# EAGLE design Braille_Cell (EAGLE 7.2.0)
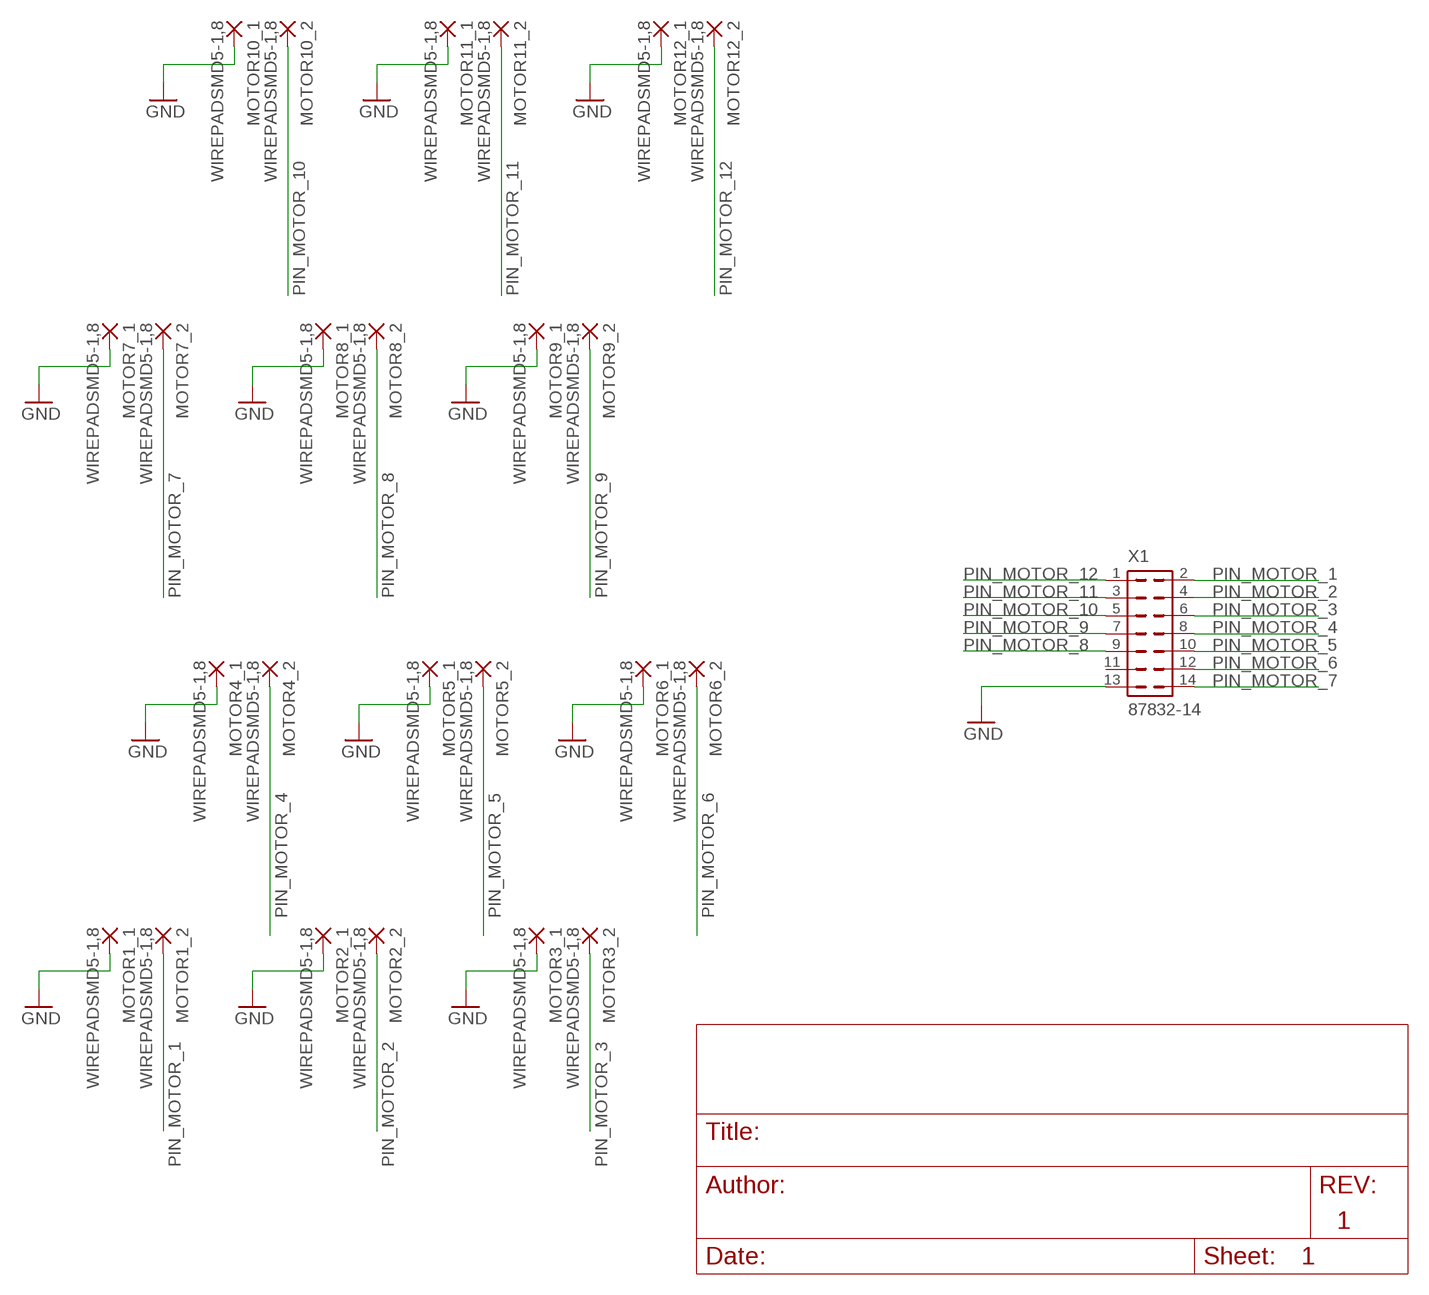
[diagram p0: schematic, sheet 1]
FRAME1 (DINA4_P): AUTHOR: Christoph Ulbinger, BSc; TITLE: Braille Cell

## Parts
MOTOR1_1  WIREPADSMD5-1,8  [5-1,8]
MOTOR1_2  WIREPADSMD5-1,8  [5-1,8]
MOTOR2_1  WIREPADSMD5-1,8  [5-1,8]
MOTOR2_2  WIREPADSMD5-1,8  [5-1,8]
MOTOR3_1  WIREPADSMD5-1,8  [5-1,8]
MOTOR3_2  WIREPADSMD5-1,8  [5-1,8]
MOTOR4_1  WIREPADSMD5-1,8  [5-1,8]
MOTOR4_2  WIREPADSMD5-1,8  [5-1,8]
MOTOR5_1  WIREPADSMD5-1,8  [5-1,8]
MOTOR5_2  WIREPADSMD5-1,8  [5-1,8]
MOTOR6_1  WIREPADSMD5-1,8  [5-1,8]
MOTOR6_2  WIREPADSMD5-1,8  [5-1,8]
MOTOR7_1  WIREPADSMD5-1,8  [5-1,8]
MOTOR7_2  WIREPADSMD5-1,8  [5-1,8]
MOTOR8_1  WIREPADSMD5-1,8  [5-1,8]
MOTOR8_2  WIREPADSMD5-1,8  [5-1,8]
MOTOR9_1  WIREPADSMD5-1,8  [5-1,8]
MOTOR9_2  WIREPADSMD5-1,8  [5-1,8]
MOTOR10_1  WIREPADSMD5-1,8  [5-1,8]
MOTOR10_2  WIREPADSMD5-1,8  [5-1,8]
MOTOR11_1  WIREPADSMD5-1,8  [5-1,8]
MOTOR11_2  WIREPADSMD5-1,8  [5-1,8]
MOTOR12_1  WIREPADSMD5-1,8  [5-1,8]
MOTOR12_2  WIREPADSMD5-1,8  [5-1,8]
X1  87832-14  [87832-14]

## Nets
GND: MOTOR1_1.1(P) MOTOR2_1.1(P) MOTOR3_1.1(P) MOTOR4_1.1(P) MOTOR5_1.1(P) MOTOR6_1.1(P) MOTOR7_1.1(P) MOTOR8_1.1(P) MOTOR9_1.1(P) MOTOR10_1.1(P) MOTOR11_1.1(P) MOTOR12_1.1(P) X1.13
PIN_MOTOR_1: MOTOR1_2.1(P) X1.2
PIN_MOTOR_2: MOTOR2_2.1(P) X1.4
PIN_MOTOR_3: MOTOR3_2.1(P) X1.6
PIN_MOTOR_4: MOTOR4_2.1(P) X1.8
PIN_MOTOR_5: MOTOR5_2.1(P) X1.10
PIN_MOTOR_6: MOTOR6_2.1(P) X1.12
PIN_MOTOR_7: MOTOR7_2.1(P) X1.14
PIN_MOTOR_8: MOTOR8_2.1(P) X1.9
PIN_MOTOR_9: MOTOR9_2.1(P) X1.7
PIN_MOTOR_10: MOTOR10_2.1(P) X1.5
PIN_MOTOR_11: MOTOR11_2.1(P) X1.3
PIN_MOTOR_12: MOTOR12_2.1(P) X1.1
Unconnected: X1.11

## Library data of the parts
MOTOR1_1 MOTOR1_2 MOTOR2_1 MOTOR2_2 MOTOR3_1 MOTOR3_2 MOTOR4_1 MOTOR4_2 MOTOR5_1 MOTOR5_2 MOTOR6_1 MOTOR6_2 MOTOR7_1 MOTOR7_2 MOTOR8_1 MOTOR8_2 MOTOR9_1 MOTOR9_2 MOTOR10_1 MOTOR10_2 MOTOR11_1 MOTOR11_2 MOTOR12_1 MOTOR12_2 = wirepad:WIREPAD: Wire PAD connect wire on PCB
X1 = con-molex:87832-14: Milli-Grid Header 2.00mm (.079") Pitch; OC_FARNELL: 7434698; OC_NEWARK: unknown

## Board
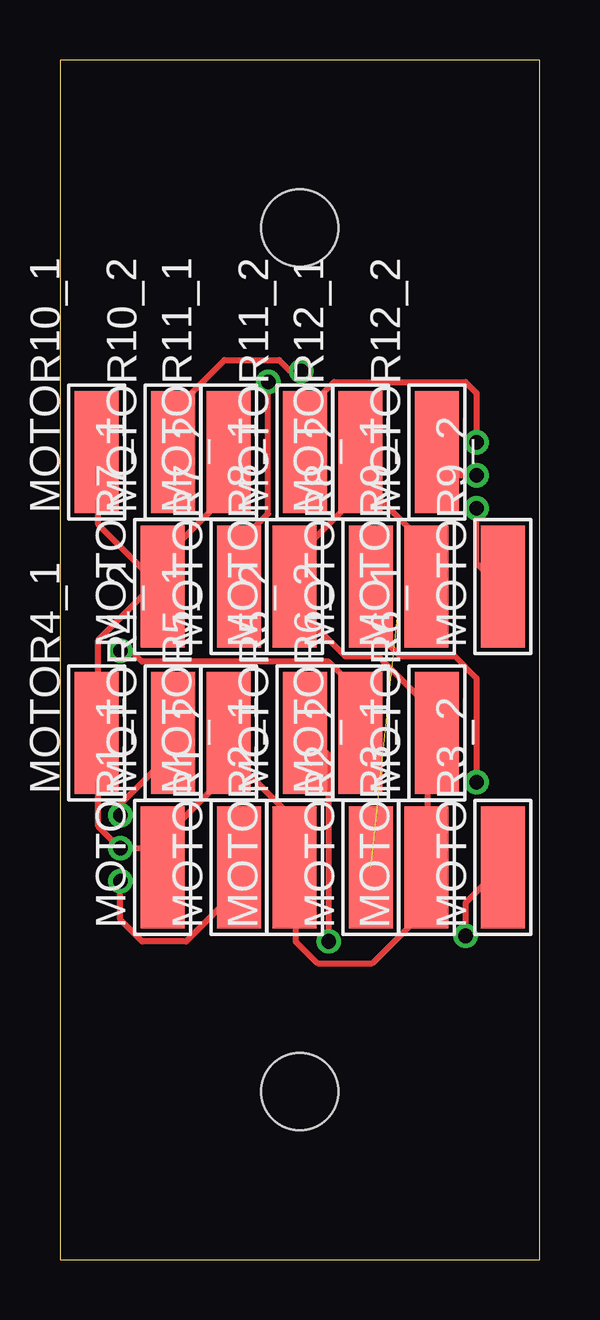
[diagram p1: board, top side]
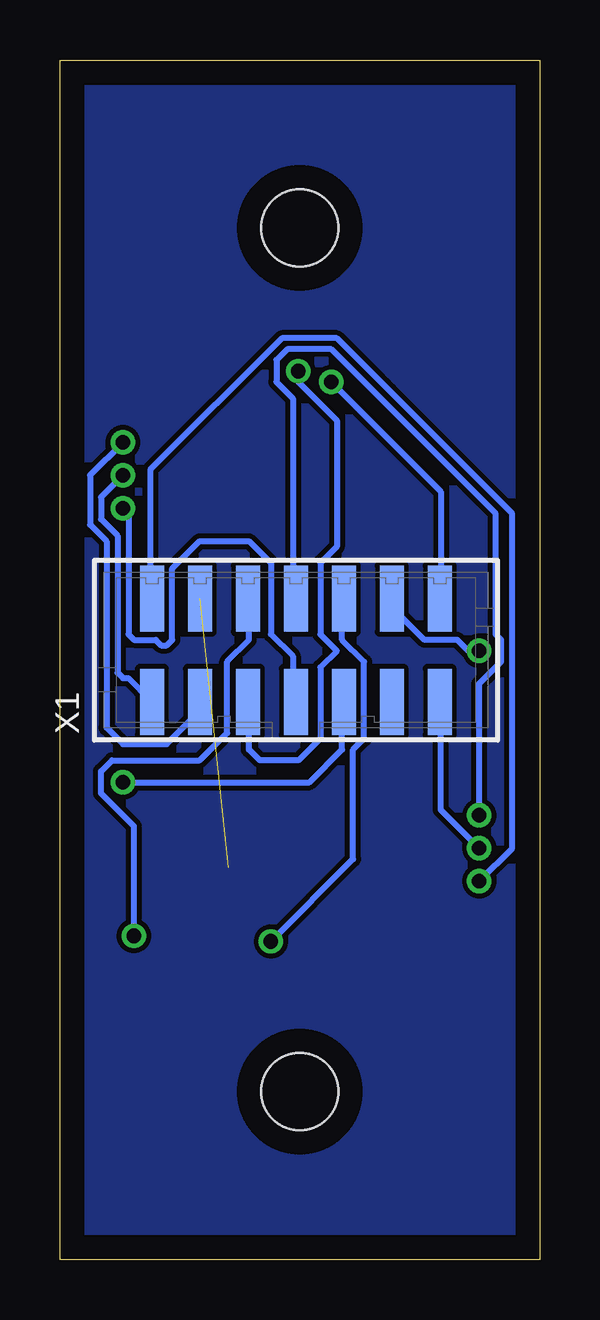
[diagram p2: board, bottom side, seen from below]

Size 20 x 50 mm. Coordinates in mm from the lower left corner, seen from the top.
Outline: 0,0 20,0 20,50 0,50 0,0
Copper layers (1*16): Top 0.035mm / dielectric 1.5mm / Bottom 0.035mm
Design rules "default": minimum track width 10mil, minimum drill 24mil, track to track 8mil, track to pad 8mil, pad to pad 8mil, via to via 8mil, smd to smd 8mil, copper to edge 40mil, drill to drill 8mil, minimum pad ring 10mil, minimum via ring 8mil, stop-mask expansion 4mil, vias tented up to drill 0mil, thermal gap 10mil
Holes 3.2 mm at 10,43 10,7

### Footprints (pad centres in the part's own frame; a part is rotated, then mirrored left to right if it is on the bottom)
5-1,8 = smd 1.829 x 5.08: 1 0,0
87832-14 = smd 1 x 2.75: 1 -6,-2.15; 2 -6,2.15; 3 -4,-2.15; 4 -4,2.15; 5 -2,-2.15; 6 -2,2.15; 7 0,-2.15; 8 0,2.15; 9 2,-2.15; 10 2,2.15; 11 4,-2.15; 12 4,2.15; 13 6,-2.15; 14 6,2.15

### Placement (x,y rotation side)
MOTOR1_1  4.28,16.35 0 top
MOTOR1_2  7.47,16.35 0 top
MOTOR2_1  9.78,16.35 0 top
MOTOR2_2  12.97,16.35 0 top
MOTOR3_1  15.28,16.35 0 top
MOTOR3_2  18.48,16.35 0 top
MOTOR4_1  1.52,21.95 0 top
MOTOR4_2  4.72,21.95 0 top
MOTOR5_1  7.03,21.95 0 top
MOTOR5_2  10.22,21.95 0 top
MOTOR6_1  15.72,21.95 0 top
MOTOR6_2  12.53,21.95 0 top
MOTOR7_1  4.28,28.05 0 top
MOTOR7_2  7.47,28.05 0 top
MOTOR8_1  9.78,28.05 0 top
MOTOR8_2  12.97,28.05 0 top
MOTOR9_1  15.28,28.05 0 top
MOTOR9_2  18.48,28.05 0 top
MOTOR10_1  1.52,33.65 0 top
MOTOR10_2  4.72,33.65 0 top
MOTOR11_1  7.03,33.65 0 top
MOTOR11_2  10.22,33.65 0 top
MOTOR12_1  12.53,33.65 0 top
MOTOR12_2  15.72,33.65 0 top
X1  10.16,25.4 0 bottom

### Tracks (layer width: path | path; a pad name or v marks a point on that pad's centre or on a via)
GND  (via drill 0.61)
  Top 0.254: 12.34,31.77 9.83,29.26 9.83,28.12 MOTOR8_1.1 9.83,27.89 9.83,27.2 11.89,25.15 13.26,25.15 15.54,22.86 15.54,22.17 MOTOR6_1.1 15.54,21.95 15.32,21.72 15.32,16.46 MOTOR3_1.1 15.09,16.23 15.09,14.4 13.03,12.34 10.74,12.34 9.83,13.26 9.83,16.23 MOTOR2_1.1 9.6,16.46 9.6,18.52 7.32,20.8 | 12.34,31.77 12.34,33.6 MOTOR12_1.1 12.34,31.77 | 12.34,31.77 13.26,31.77 15.09,29.95 15.09,28.12 MOTOR9_1.1 | 3.66,28.57 4.12,28.12 MOTOR7_1.1 | 3.66,28.57 1.6,30.63 1.6,33.6 MOTOR10_1.1 | 3.66,28.57 6.86,31.77 6.86,33.6 MOTOR11_1.1 | 3.66,28.57 MOTOR7_1.1 | 3.66,16.92 4.12,16.46 MOTOR1_1.1 3.66,16.92 | 3.66,16.92 3.43,17.14 v2.52,17.14 1.6,18.06 1.6,21.95 MOTOR4_1.1 1.6,22.17 1.6,25.83 3.66,27.89 4.12,27.89 MOTOR7_1.1 | 7.32,20.8 7.09,21.03 7.09,21.95 MOTOR5_1.1 7.32,20.8 | 3.66,16.92 7.32,20.57 7.32,20.8
  Bottom 0.254: v2.52,17.14 4.12,18.75 4.12,23.09 X1.13
N$1
  pour Bottom: 0,49.66 0,0 19.56,0 19.56,49.66
PIN_MOTOR_1  (via drill 0.61)
  Top 0.254: v2.52,15.77 2.52,14.17 3.43,13.26 5.26,13.26 7.32,15.32 7.32,16.23 MOTOR1_2.1
  Bottom 0.254: v2.52,15.77 1.14,17.14 1.14,31.09 8.46,38.41 10.74,38.41 16.23,32.92 16.23,27.66 X1.2
PIN_MOTOR_2  (1 unrouted)
PIN_MOTOR_3  (via drill 0.61)
  Top 0.254: v16.92,13.49 16.92,14.86 18.29,16.23 MOTOR3_2.1
  Bottom 0.254: v16.92,13.49 16.92,18.06 18.29,19.43 18.29,20.34 17.83,20.8 14.17,20.8 13.03,21.95 13.03,24.92 12.12,25.83 12.12,27.43 X1.6
PIN_MOTOR_4  (via drill 0.61)
  Top 0.254: v2.52,18.52 2.52,18.97 4.57,21.03 4.57,21.95 MOTOR4_2.1
  Bottom 0.254: v2.52,18.52 2.52,24 1.6,24.92 1.6,25.83 1.83,26.06 1.83,31.09 8.69,37.95 10.52,37.95 10.97,37.49 10.97,36.58 10.29,35.89 10.29,27.66 X1.8
PIN_MOTOR_5  (via drill 0.61)
  Top 0.254: v11.2,13.26 11.2,21.03 10.29,21.95 MOTOR5_2.1
  Bottom 0.254: v11.2,13.26 7.77,16.69 7.77,21.26 7.32,21.72 7.32,24.92 8.23,25.83 8.23,27.43 X1.10
PIN_MOTOR_6  (via drill 0.61)
  Top 0.254: v2.52,25.38 2.97,25.38 3.43,24.92 11.2,24.92 12.34,23.77 12.34,22.17 MOTOR6_2.1
  Bottom 0.254: v2.52,25.38 2.97,25.38 3.43,25.83 4.8,25.83 5.94,26.98 5.94,27.43 X1.12
PIN_MOTOR_7  (via drill 0.61)
  Top 0.254: v8.69,36.58 8.69,31.09 7.54,29.95 7.54,28.12 MOTOR7_2.1
  Bottom 0.254: v8.69,36.58 4.12,32 4.12,27.66 X1.14
PIN_MOTOR_8  (via drill 0.61)
  Top 0.254: v17.37,19.89 17.37,24.23 16.46,25.15 14.17,25.15 13.03,26.29 13.03,27.89 MOTOR8_2.1
  Bottom 0.254: v17.37,19.89 9.6,19.89 8.23,21.26 8.23,23.09 X1.9
PIN_MOTOR_9  (via drill 0.61)
  Top 0.254: v17.37,31.32 17.37,29.03 18.29,28.12 MOTOR9_2.1
  Bottom 0.254: v17.37,31.32 17.14,31.09 17.14,26.06 16.92,25.83 16,25.83 15.77,25.6 15.54,25.6 15.32,25.83 15.32,28.8 14.17,29.95 12.12,29.95 11.2,29.03 11.2,26.06 10.29,25.15 10.29,23.32 X1.7
PIN_MOTOR_10  (via drill 0.61)
  Top 0.254: v10.06,37.03 9.6,37.03 9.14,37.49 6.86,37.49 4.8,35.43 4.8,33.83 MOTOR10_2.1
  Bottom 0.254: v10.06,37.03 10.06,36.58 8.46,34.98 8.46,29.72 9.14,29.03 9.14,26.06 8.46,25.38 9.14,24.69 9.14,21.72 10.06,20.8 11.66,20.8 12.12,21.26 12.12,23.09 X1.5
PIN_MOTOR_11  (via drill 0.61)
  Top 0.254: v17.37,34.06 17.37,36.12 16.92,36.58 11.43,36.58 10.29,35.43 10.29,33.83 MOTOR11_2.1
  Bottom 0.254: v17.37,34.06 18.75,32.69 18.75,30.63 18.06,29.95 18.06,22.17 17.37,21.49 15.54,21.49 14.17,22.86 14.17,23.09 X1.3
PIN_MOTOR_12  (via drill 0.61)
  Top 0.254: v17.37,32.69 16.69,32.69 15.77,33.6 MOTOR12_2.1
  Bottom 0.254: v17.37,32.69 18.29,31.77 18.29,30.86 17.6,30.18 17.6,24.46 17.37,24.23 17.14,24.23 16.23,23.32 X1.1